# EasyEDA Pro project Main.eprj, schematic powermanagmen_1
Board Name: pow; Create Date: 2026-01-31; Page Name: powermanagmen; Project Name: Main; Schematic Name: powermanagmen_1; Update Date: 2026-01-31; File: powermanagmen; Id: /; Sheet: /
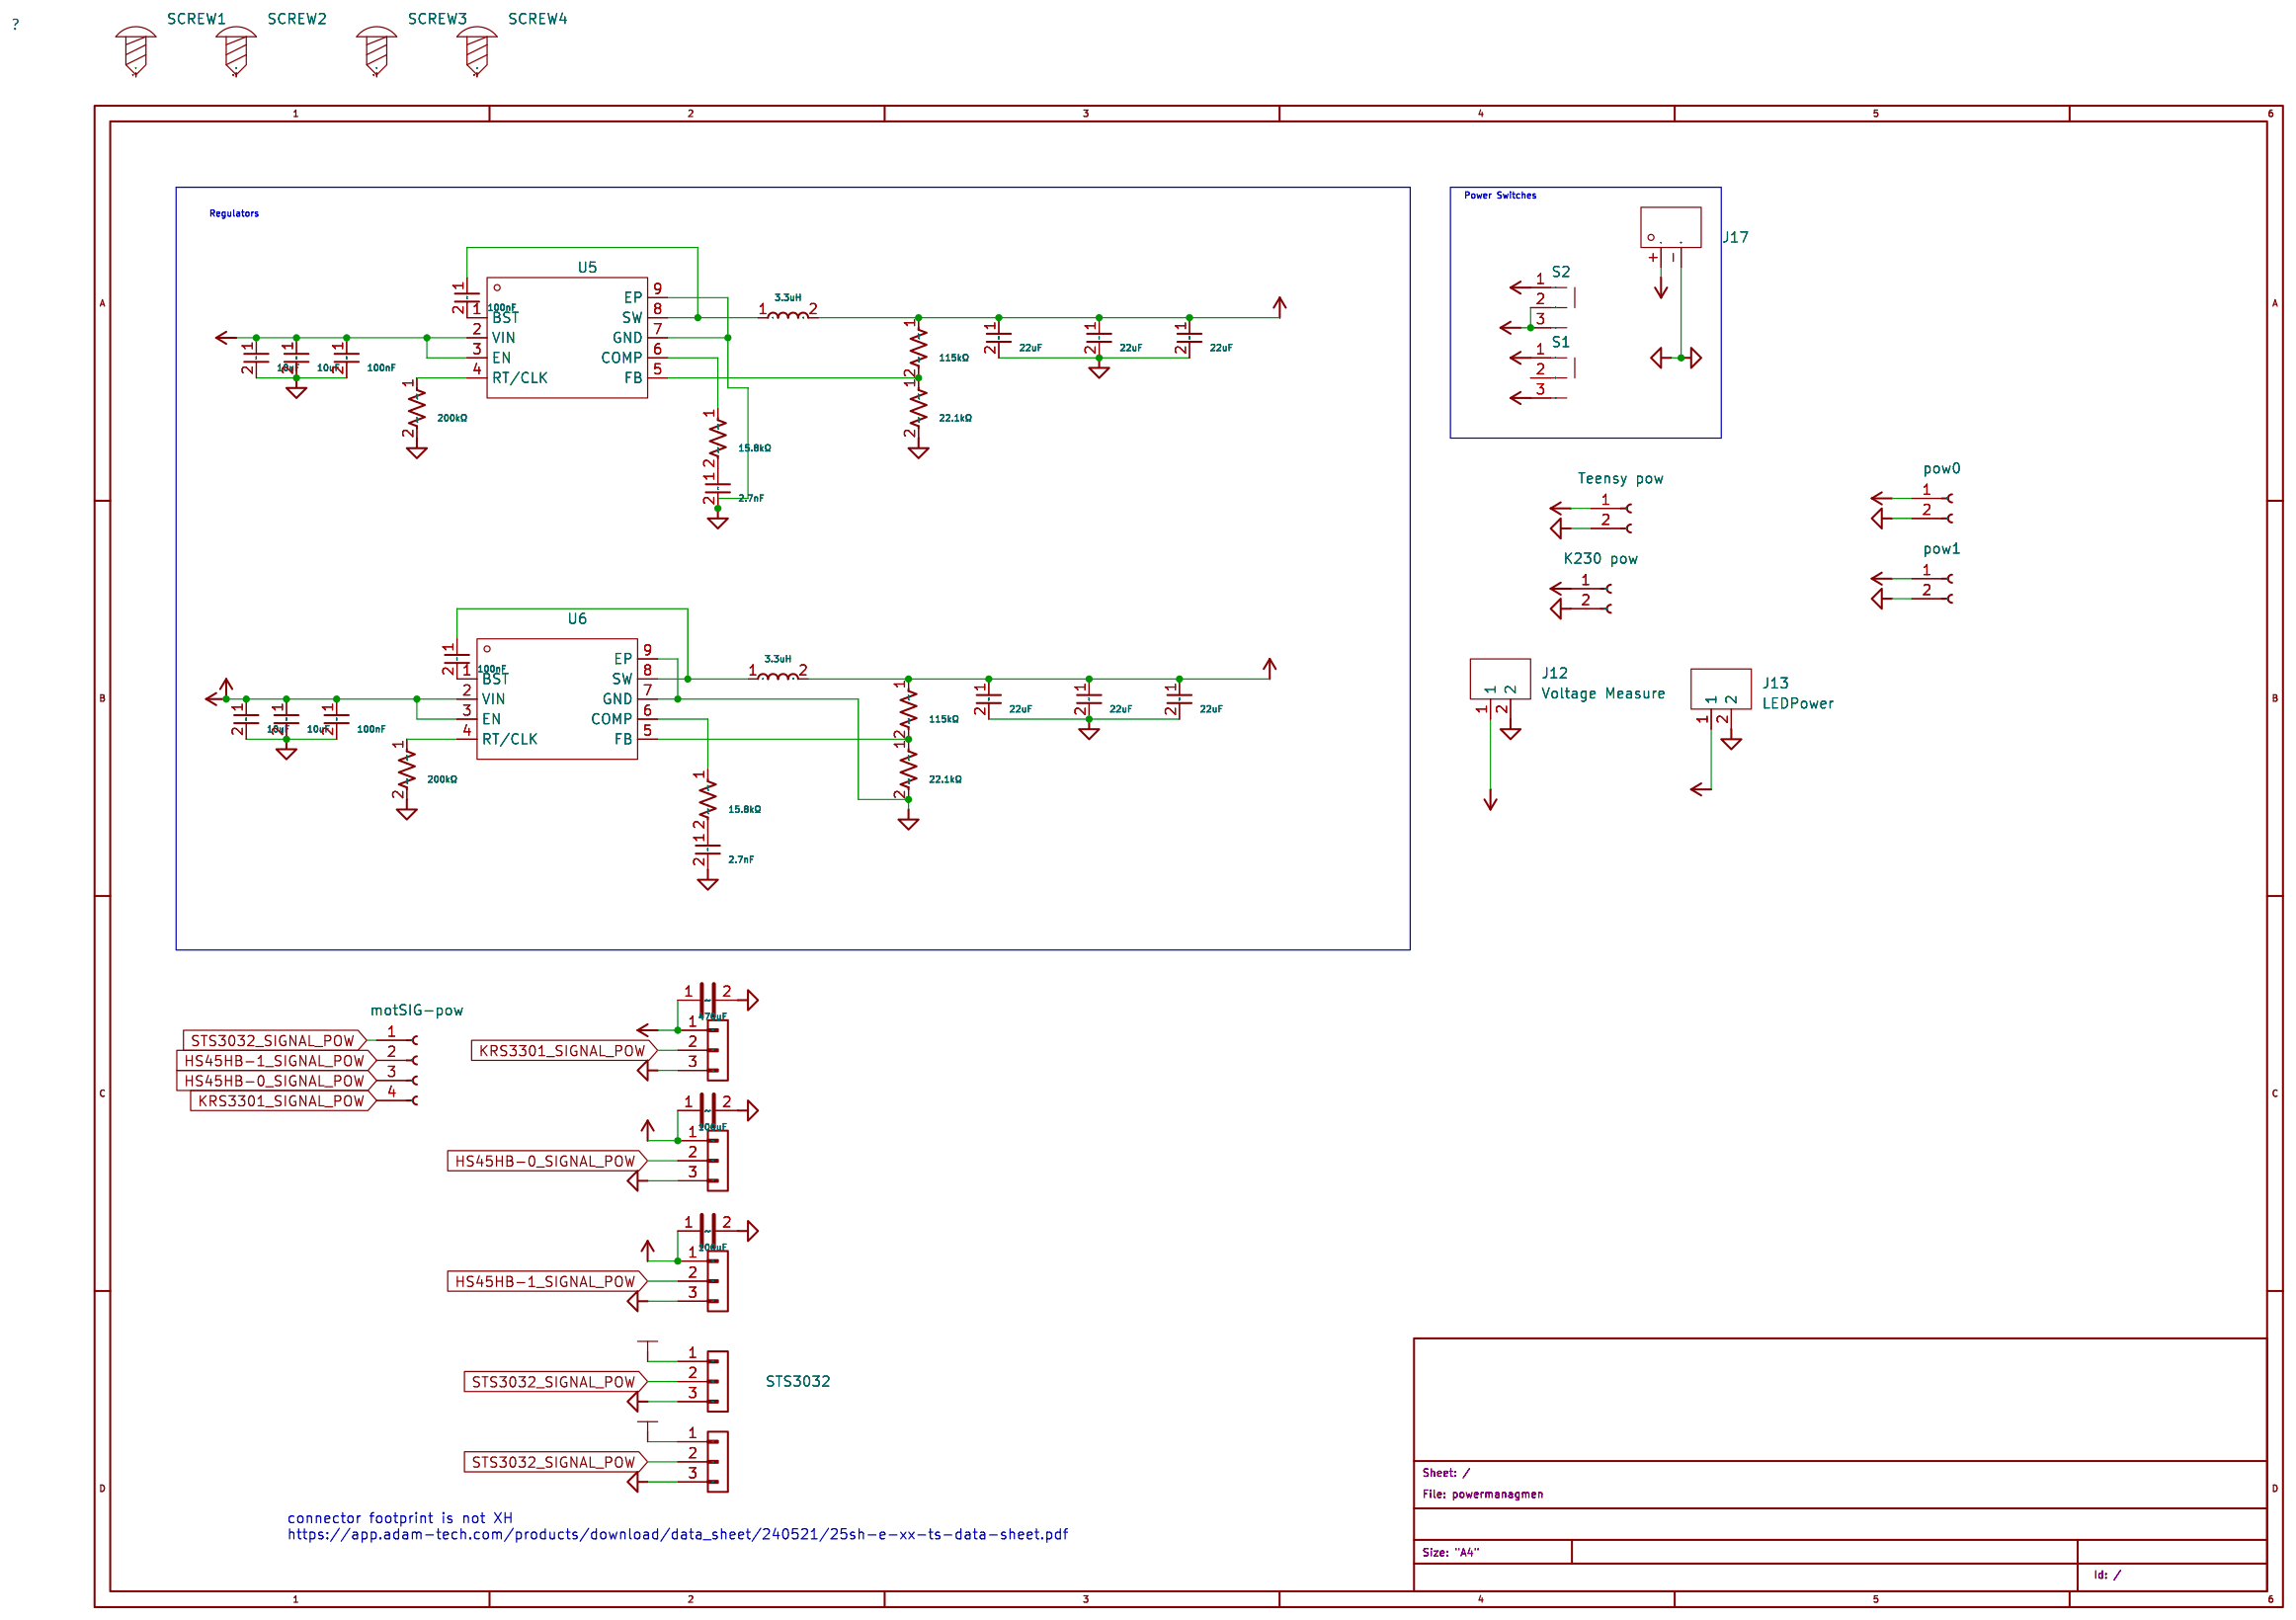
[diagram p3: schematic sheet]

## Parts
C5  10uF  [C0603]
C22  10uF  [C0603]
C24  100nF  [C0603]
C40  100nF  [C0603]
C41  22uF  [C0603]
C42  22uF  [C0603]
C43  22uF  [C0603]
C44  2.7nF  [C0603]
C45  10uF  [C0603]
C46  10uF  [C0603]
C47  100nF  [C0603]
C48  100nF  [C0603]
C49  22uF  [C0603]
C50  22uF  [C0603]
C51  22uF  [C0603]
C52  2.7nF  [C0603]
C54  470uF  [C0603]
C55  100uF  [C0603]
C56  100uF  [C0603]
J1  STS3032  [CONN-TH_3P-P2.50_WAFER-XH2.54-3PZZ-H62]
J2  B3B-XH-A(LF)(SN)  [CONN-TH_3P-P2.50_WAFER-XH2.54-3PZZ-H62]
J3  K230 pow  [CONN-TH_2P-P2.50_HX25003-2A]
J12  Voltage Measure  [CONN-TH_2P-P2.50_HX25003-2A]
J13  LEDPower  [CONN-TH_2P-P2.50_HX25003-2A]
J14  PZ254V-11-03P  [HDR-TH_3P-P2.54-V-M_PZ254V-11-03P]
J15  PZ254V-11-03P  [HDR-TH_3P-P2.54-V-M_PZ254V-11-03P]
J16  PZ254V-11-03P  [HDR-TH_3P-P2.54-V-M_PZ254V-11-03P]
J17  XT60-F  [CONN-TH_XT60PB-F]
J35  motSIG-pow  [CONN-TH_B4B-XH-A-BK-LF-SN]
J44  Teensy pow  [CONN-TH_2P-P2.50_HX25003-2A]
J45  pow0  [CONN-TH_2P-P2.50_HX25003-2A]
J46  pow1  [CONN-TH_2P-P2.50_HX25003-2A]
L5  3.3uH  [IND-SMD_CYA0650-3.3UH]
L6  3.3uH  [IND-SMD_CYA0650-3.3UH]
R14  200kΩ  [R0603]
R15  15.8kΩ  [R0603]
R16  115kΩ  [R0603]
R17  22.1kΩ  [R0603]
R18  200kΩ  [R0603]
R19  15.8kΩ  [R0603]
R20  115kΩ  [R0603]
R21  22.1kΩ  [R0603]
S1  SS-12M11G4  [SW-TH_XKB_SS-12M11XX]
S2  SS-12M11G4  [SW-TH_XKB_SS-12M11XX]
SCREW1  -  [Screw-Hole-M2]
SCREW2  -  [Screw-Hole-M2]
SCREW3  -  [Screw-Hole-M2]
SCREW4  -  [Screw-Hole-M2]
U5  AP64500SP-13  [SO-8_L4.9-W3.9-P1.27-LS6.0-BL-EP]
U6  AP64500SP-13  [SO-8_L4.9-W3.9-P1.27-LS6.0-BL-EP]

## Library data of the parts
C5 C22 C45 C46 = CL10A106MO8NQNC: Capacitance:10uF Tolerance:±20% Tolerance:±20% Voltage Rating:16V Temperature Coefficient:X5R; LCSC Part Name: 10uF ±20% 16V; Supplier Part: C92487; Manufacturer: SAMSUNG(三星); Supplier Footprint: 0603; JLCPCB Part Class: Extended Part; Datasheet: https://item.szlcsc.com/datasheet/CL10A106MO8NQNC/93680.html; Supplier: LCSC; Tolerance: ±20%; Voltage Rating: 16V; Temperature Coefficient: X5R
C24 C40 C47 C48 C54-C56 = TCC0603X7R104K500CT: Capacitance:100nF Tolerance:±10% Tolerance:±10% Voltage Rating:50V Temperature Coefficient:X7R; LCSC Part Name: 100nF ±10% 50V; Supplier Part: C282519; Manufacturer: CCTC(三环); Supplier Footprint: 0603; JLCPCB Part Class: Extended Part; Datasheet: https://item.szlcsc.com/datasheet/TCC0603X7R104K500CT/268639.html; Supplier: LCSC; Tolerance: ±10%; Voltage Rating: 50V; Temperature Coefficient: X7R
C41-C43 C49-C51 = CL10A226MP8NUNE: Capacitance:22uF Tolerance:±20% Tolerance:±20% Voltage Rating:10V Temperature Coefficient:X5R; LCSC Part Name: 22uF ±20% 10V; Supplier Part: C86295; Manufacturer: SAMSUNG(三星); Supplier Footprint: 0603; JLCPCB Part Class: Extended Part; Datasheet: https://item.szlcsc.com/datasheet/CL10A226MP8NUNE/87471.html; Supplier: LCSC; Tolerance: ±20%; Voltage Rating: 10V; Temperature Coefficient: X5R
C44 C52 = GRM1885C1H272JA01D: Capacitance:2.7nF Tolerance:±5% Tolerance:±5% Voltage Rating:50V Temperature Coefficient:C0G; LCSC Part Name: 2.7nF ±5% 50V; Supplier Part: C77034; Manufacturer: muRata(村田); Supplier Footprint: 0603; JLCPCB Part Class: Extended Part; Datasheet: https://item.szlcsc.com/datasheet/GRM1885C1H272JA01D/78161.html; Supplier: LCSC; Tolerance: ±5%; Voltage Rating: 50V; Temperature Coefficient: C0G
J1 J2 = B3B-XH-A(LF)(SN): Pins Structure:1x3P Pitch:2.5mm Mounting Type:Through Hole Reference Series:XH Number of Pins:3P Number of Rows:1 Number of PINs Per Row:3 Row Spacing:- Current Rating:3A Contact Material:Brass Contact Plating:Tin Operating Temperature:-25℃~+85℃ Operating; LCSC Part Name: 1x3P 间距:2.5mm 直插 系列:XH; Supplier Part: C144394; Manufacturer: JST; Supplier Footprint: 插件,P=2.5mm; JLCPCB Part Class: Extended Part; Datasheet: https://item.szlcsc.com/datasheet/B3B-XH-A(LF)(SN)/155726.html; Supplier: LCSC; Pins Structure: 1x3P; Pitch: 2.5mm; Mounting Type: Through Hole; Reference Series: XH; Number of Pins: 3P; Number of Rows: 1; Number of PINs Per Row: 3; Current Rating: 3A; Contact Material: Brass; Contact Plating: Tin; Operating Temperature: -25℃~+85℃; Voltage Rating: 250V; Plastic Material: PA66; Flame Retardant Rating: UL94V-0; Supplementary Features: K Pin; Color: White; Z-Height of the Board: 7mm; X-Length of Bottom Edge on Board (Spacing Line): 9.9mm; Y-Width of Bottom Edge on Board: 5.75mm
J3 J44-J46 = B2B-XH-A(LF)(SN): Pins Structure:1x2P Pitch:2.5mm Mounting Type:Through Hole Reference Series:XH Number of Pins:2P Number of Rows:1 Number of PINs Per Row:2 Row Spacing:- Current Rating:3A Contact Material:Brass Contact Plating:Tin Operating Temperature:-25℃~+85℃ Operating; LCSC Part Name: 1x2P 间距:2.5mm 直插 系列:XH; Supplier Part: C158012; Manufacturer: JST; Supplier Footprint: 插件,P=2.5mm; JLCPCB Part Class: Extended Part; Datasheet: https://item.szlcsc.com/datasheet/B2B-XH-A(LF)(SN)/169360.html; Supplier: LCSC; Pins Structure: 1x2P; Pitch: 2.5mm; Mounting Type: Through Hole; Reference Series: XH; Number of Pins: 2P; Number of Rows: 1; Number of PINs Per Row: 2; Current Rating: 3A; Contact Material: Brass; Contact Plating: Tin; Operating Temperature: -25℃~+85℃; Voltage Rating: 250V; Plastic Material: PA66; Flame Retardant Rating: UL94V-0; Supplementary Features: K Pin; Color: White; Z-Height of the Board: 7mm; X-Length of Bottom Edge on Board (Spacing Line): 7.4mm; Y-Width of Bottom Edge on Board: 5.75mm
J12 J13 = ZX-XH2.54-2PZZ: Pins Structure:1x2P Pitch:2.5mm Mounting Type:Through Hole Reference Series:XH Number of Pins:2P Number of Rows:1 Number of PINs Per Row:2 Row Spacing:- Current Rating:2A Contact Material:Brass Contact Plating:Tin Operating Temperature:-25℃~+85℃ Operating; LCSC Part Name: 1x2P 间距:2.5mm 直插 系列:XH; Supplier Part: C7429632; Manufacturer: Megastar(兆星); Supplier Footprint: 插件,P=2.5mm; JLCPCB Part Class: Extended Part; Datasheet: https://item.szlcsc.com/datasheet/ZX-XH2.54-2PZZ/8427549.html; Supplier: LCSC; Pins Structure: 1x2P; Pitch: 2.5mm; Mounting Type: Through Hole; Reference Series: XH; Number of Pins: 2P; Number of Rows: 1; Number of PINs Per Row: 2; Current Rating: 2A; Contact Material: Brass; Contact Plating: Tin; Operating Temperature: -25℃~+85℃; Voltage Rating: 250V; Plastic Material: PA66; Flame Retardant Rating: UL94V-0; Color: White; Z-Height of the Board: 7mm; X-Length of Bottom Edge on Board (Spacing Line): 7.5mm; Y-Width of Bottom Edge on Board: 5.9mm
J14-J16 = PZ254V-11-03P: Pin Structure:1x3P Pitch:2.54mm Row Spacing:- Circluar Pins/Square Pins:Pin Header Mounting Type:Through Hole Number of Rows:1 Number of Pins:3P Current Rating:3A Voltage Rating (Max):250V Length of Mating Pin:6mm Insulation Height:2.5mm Length of End Con; LCSC Part Name: 1x3P 间距:2.54mm 方针 直插; Supplier Part: C2937625; Manufacturer: XFCN(兴飞); Supplier Footprint: 插件,P=2.54mm; JLCPCB Part Class: Extended Part; Datasheet: https://item.szlcsc.com/datasheet/PZ254V-11-03P/3293280.html; Supplier: LCSC; Pin Structure: 1x3P; Pitch: 2.54mm; Circluar Pins/Square Pins: Pin Header; Mounting Type: Through Hole; Number of Rows: 1; Number of Pins: 3P; Current Rating: 3A; Voltage Rating (Max): 250V; Length of Mating Pin: 6mm; Insulation Height: 2.5mm; Length of End Connection Pin: 3mm; Operating Temperature: -40℃~+105℃; Color: Black
J17 = XT60-F: Power:- Output:- Input:- Size:- Interface:- Type:- Colour:Yellow MaximumCurrent:- Type:Banana Connector RatedVoltage:- Type1:- NumberOfUSBHoles:- InterfaceType:Female MetalMaterial:Gold Plated InsulationMaterial:- RatedCurrent:- RecommendedWireGauge:- Fla; LCSC Part Name: AMASS(艾迈斯)XT60模型插头 3.5mm镀金香蕉头母头 XT60-F; Supplier Part: C98734; Manufacturer: AMASS(艾迈斯); JLCPCB Part Class: Extended Part; Datasheet: https://item.szlcsc.com/datasheet/XT60-F/99944.html; Supplier: LCSC; Type: Banana Connector; Colour: Yellow; InterfaceType: Female; MetalMaterial: Gold Plated
J35 = B4B-PH-K-S(LF)(SN)_C131334: Pins Structure:1x4P Pitch:2mm Mounting Type:Through Hole Reference Series:PH Number of Pins:4P Number of Rows:1 Number of PINs Per Row:4 Row Spacing:- Current Rating:2A Contact Material:Brass Contact Plating:Tin Operating Temperature:-25℃~+85℃ Operating T; LCSC Part Name: 1x4P 间距:2mm 直插 系列:PH; Supplier Part: C131334; Manufacturer: JST; Manufacturer Part: B4B-PH-K-S(LF)(SN); Supplier Footprint: 插件,P=2mm; JLCPCB Part Class: Extended Part; Datasheet: https://item.szlcsc.com/datasheet/B4B-PH-K-S(LF)(SN)/142627.html; Supplier: LCSC; Pins Structure: 1x4P; Pitch: 2mm; Mounting Type: Through Hole; Reference Series: PH; Number of Pins: 4P; Number of Rows: 1; Number of PINs Per Row: 4; Current Rating: 2A; Contact Material: Brass; Contact Plating: Tin; Operating Temperature: -25℃~+85℃; Voltage Rating: 100V; Plastic Material: PA66; Flame Retardant Rating: UL94V-0; Supplementary Features: K Pin; Color: White; Z-Height of the Board: 6mm; X-Length of Bottom Edge on Board (Spacing Line): 9.9mm; Y-Width of Bottom Edge on Board: 4.5mm
L5 L6 = CYA0650-3.3UH: Inductance: Tolerance:±20% Tolerance:±20% Current Rating: DC Resistance(DCR):19.9mΩ; LCSC Part Name: 3.3uH ±20%; Supplier Part: C5189753; Manufacturer: SHOU HAN(首韩); Supplier Footprint: SMD,7.2x6.6mm; JLCPCB Part Class: Extended Part; Datasheet: https://atta.szlcsc.com/upload/public/pdf/source/20250110/D8E5DDB17316764D39629F3242DE5FE2.pdf; Supplier: LCSC; Tolerance: ±20%; DC Resistance(DCR): 19.9mΩ
R14 R18 = 0603WAF2003T5E: Type:Thick Film Resistors Resistance:200kΩ Tolerance:±1% Tolerance:±1% Power(Watts): Overload Voltage (Max): Temperature Coefficient:±100ppm/℃ Temperature Coefficient:±100ppm/℃ Operating Temperature Range:-55℃~+155℃ Operating Temperature Range:-55℃~+155℃; LCSC Part Name: 200kΩ ±1% 100mW 厚膜电阻; Supplier Part: C25811; Manufacturer: UNI-ROYAL(厚声); Supplier Footprint: 0603; JLCPCB Part Class: Basic Part; Datasheet: https://atta.szlcsc.com/upload/public/pdf/source/20200306/C422600_1E6D84923E4A46A82E41ADD87F860B5C.pdf; Supplier: LCSC; Type: Thick Film Resistors; Tolerance: ±1%; Temperature Coefficient: ±100ppm/℃; Operating Temperature Range: -55℃~+155℃
R15 R19 = FRC0603F1582TS: Type:Thick Film Resistor Resistance:15.8kΩ Tolerance:±1% Tolerance:±1% Power(Watts):100mW Voltage-Supply(Max):75V Temperature Coefficient:±100ppm/℃ Temperature Coefficient:±100ppm/℃ Operating Temperature:-55℃~+155℃ Operating Temperature:-55℃~+155℃; LCSC Part Name: 15.8kΩ ±1% 100mW 厚膜电阻; Supplier Part: C2960716; Manufacturer: FOJAN(富捷); Supplier Footprint: 0603; JLCPCB Part Class: Extended Part; Supplier: LCSC; Type: Thick Film Resistor; Tolerance: ±1%; Power(Watts): 100mW; Voltage-Supply(Max): 75V; Temperature Coefficient: ±100ppm/℃; Operating Temperature: -55℃~+155℃
R16 R20 = 0603WAF1153T5E: Type:Thick Film Resistor Resistance:115kΩ Tolerance:±1% Tolerance:±1% Power(Watts):100mW Voltage-Supply(Max):75V Temperature Coefficient:±100ppm/℃ Temperature Coefficient:±100ppm/℃ Operating Temperature:-55℃~+155℃ Operating Temperature:-55℃~+155℃; LCSC Part Name: 115kΩ ±1% 100mW 厚膜电阻; Supplier Part: C22783; Manufacturer: UNI-ROYAL(厚声); Supplier Footprint: 0603; JLCPCB Part Class: Extended Part; Datasheet: https://item.szlcsc.com/datasheet/0603WAF1153T5E/23510.html; Supplier: LCSC; Type: Thick Film Resistor; Tolerance: ±1%; Power(Watts): 100mW; Voltage-Supply(Max): 75V; Temperature Coefficient: ±100ppm/℃; Operating Temperature: -55℃~+155℃
R17 R21 = 0603WAF2212T5E: LCSC Part Name: 22.1kΩ ±1% 100mW 厚膜电阻; Supplier Part: C25961; Manufacturer: UNI-ROYAL(厚声); Supplier Footprint: 0603; JLCPCB Part Class: Extended Part; Datasheet: https://atta.szlcsc.com/upload/public/pdf/source/20200306/C422600_1E6D84923E4A46A82E41ADD87F860B5C.pdf; Supplier: LCSC; Type: Thick Film Resistors; Tolerance: ±1%; Temperature Coefficient: ±100ppm/℃; Operating Temperature Range: -55℃~+155℃
S1 S2 = SS-12M11G4: Circuit:SPDT Actuator Style:Rectangular Columnar Termination Style:PC Pin Length:13mm Width:7.2mm Switch Height:6.6mm Mounting Type:Through Hole Actuator Color:Black Current Rating:6A Voltage Rating:120V Life:10,000 Cycles Operating Temperature:-40℃~+85℃; LCSC Part Name: 柄长4mm 直插双档 滑动开关; Supplier Part: C2879840; Manufacturer: XKB Connection(中国星坤); Supplier Footprint: 插件,13x7.2mm; JLCPCB Part Class: Extended Part; Datasheet: https://item.szlcsc.com/datasheet/SS-12M11G4/3089136.html; Supplier: LCSC; Circuit: SPDT; Actuator Style: Rectangular Columnar; Termination Style: PC Pin; Length: 13mm; Width: 7.2mm; Switch Height: 6.6mm; Mounting Type: Through Hole; Actuator Color: Black; Current Rating: 6A; Voltage Rating: 120V; Life: 10,000 Cycles; Operating Temperature: -40℃~+85℃
SCREW1-SCREW4 = Screw-Hole-M2: Supplier Footprint: 插件
U5 U6 = AP64500SP-13: LCSC Part Name: 降压型 5A 3.8V~40V; Supplier Part: C2070920; Manufacturer: DIODES(美台); Supplier Footprint: SO-8-EP; JLCPCB Part Class: Extended Part; Datasheet: https://item.szlcsc.com/datasheet/AP64500SP-13/2162503.html; Supplier: LCSC; Function: Buck; Voltage - Supply: 3.8V~40V; Output Voltage: 800mV~39V; Output Current: 5A; Frequency - Switching: 100kHz~2.2MHz; Operating Temperature: -40℃~+85℃; Synchronous Rectifier: Yes; Number of Outputs: 1; Topology: Buck; Quiescent Current: 25uA; Switch tube (built-in/external): Built-in; Output Type: Adjustable

## Nets
+5V: C41.1 C42.1 C43.1 C54.1 C55.1 C56.1 J3.1(Pin) J14.1(Pin) J15.1(Pin) J16.1(Pin) J44.1(Pin) L5.2 R16.1
+5VM: C49.1 C50.1 C51.1 J1.1(Pin) J2.1(Pin) L6.2 R20.1
+VCC: C5.1 C22.1 C24.1 J45.1(Pin) J46.1(Pin) S2.2 S2.3 U5.2(VIN) U5.3(EN)
+BATT: J12.1 J17.+(1) S1.1 S2.1
+VMOT: C45.1 C46.1 C47.1 J13.1 S1.3 U6.2(VIN) U6.3(EN)
HS45HB-0_SIGNAL_POW: J15.2(Pin) J35.3(Pin)
HS45HB-1_SIGNAL_POW: J16.2(Pin) J35.2(Pin)
KRS3301_SIGNAL_POW: J14.2(Pin) J35.4(Pin)
POWER_GND: C5.2 C22.2 C24.2 C41.2 C42.2 C43.2 C44.2 C45.2 C46.2 C47.2 C49.2 C50.2 C51.2 C52.2 C54.2 C55.2 C56.2 J1.3(Pin) J2.3(Pin) J3.2(Pin) J12.2 J13.2 J14.3(Pin) J15.3(Pin) J16.3(Pin) J17.-(2) J44.2(Pin) J45.2(Pin) J46.2(Pin) R14.2 R17.2 R18.2 R21.2 U5.7(GND) U5.9(EP) U6.7(GND) U6.9(EP)
STS3032_SIGNAL_POW: J1.2(Pin) J2.2(Pin) J35.1(Pin)
$1N35510: C40.2 U5.1(BST)
$1N35520: C40.1 L5.1 U5.8(SW)
$1N35575: R16.2 R17.1 U5.5(FB)
$1N35837: R15.1 U5.6(COMP)
$1N35914: C44.1 R15.2
$1N35993: R14.1 U5.4(RT/CLK)
$1N36774: C48.2 U6.1(BST)
$1N36776: C48.1 L6.1 U6.8(SW)
$1N36782: R20.2 R21.1 U6.5(FB)
$1N36795: R19.1 U6.6(COMP)
$1N36798: C52.1 R19.2
$1N36802: R18.1 U6.4(RT/CLK)

Not connected (* = marked no-connect by the designer): S1 2; SCREW1 1; SCREW2 1; SCREW3 1; SCREW4 1

## Notes on the sheet
- Power Switches
- Regulators
- connector footprint is not XH
  https://app.adam-tech.com/products/download/data_sheet/240521/25sh-e-xx-ts-data-sheet.pdf
